# EAGLE design testjig (EAGLE 7.1.0)
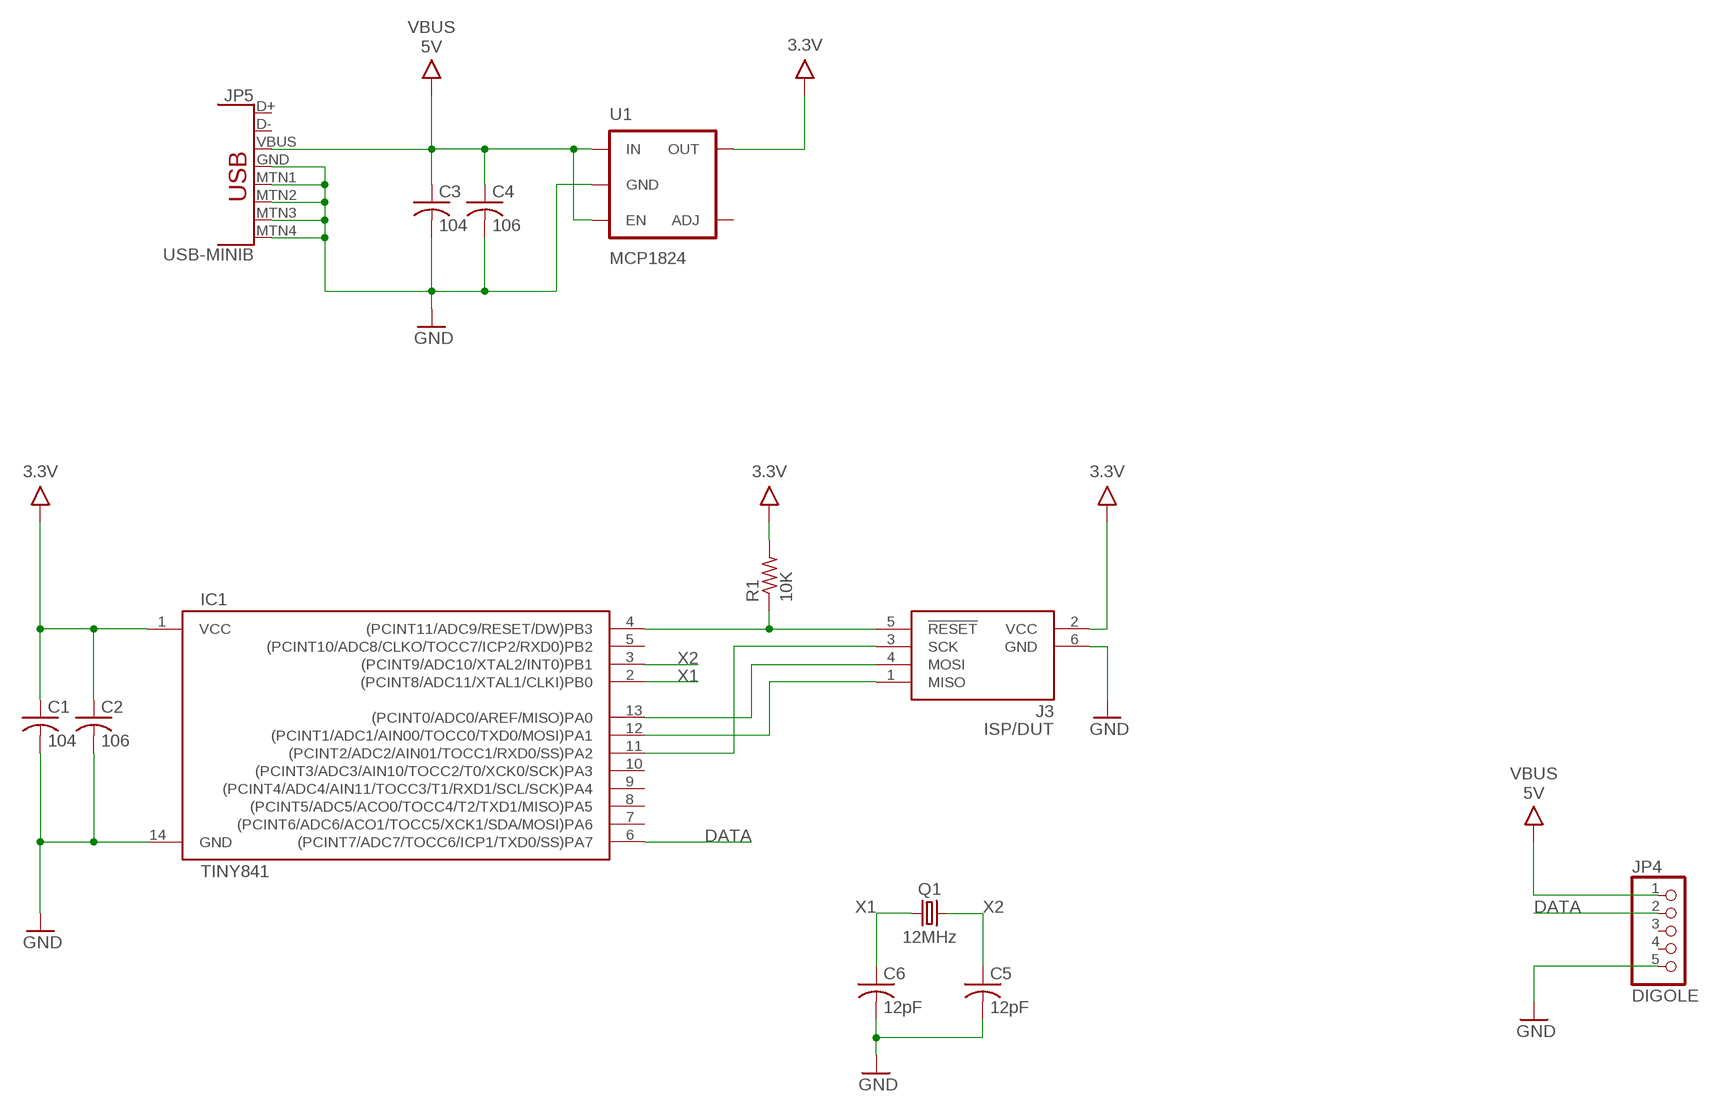
[diagram p0: schematic, sheet 1]

## Parts
C1  104  C-0603  [0603]
C2  106  C-0603  [0603]
C3  104  C-0603  [0603]
C4  106  C-0603  [0603]
C5  12pF  C-0603  [0603]
C6  12pF  C-0603  [0603]
IC1  TINY841  ATTINY441/841-SSU  [SOIC14N]
J3  ISP/DUT  AVRISP6_COMPACT  [CON6P2R]
JP4  DIGOLE  PINHD-1X05_2.54-S  [1X05-S]
JP5  USB-MINIB  [USB-MINIB]
Q1  12MHz  CRYSTALNDK5X3  [NDK_2PAD_5X3]
R1  10K  R0603  [0603]
U1  MCP1824  [SOT23-5]

## Nets
3.3V: C1.1(+) C2.1(+) IC1.1(VCC) J3.2(VCC) R1.2 U1.5(OUT)
DATA: IC1.6((PCINT7/ADC7/TOCC6/ICP1/TXD0/SS)PA7) JP4.2
GND: C1.2(-) C2.2(-) C3.2(-) C4.2(-) C5.2(-) C6.2(-) IC1.14(GND) J3.6(GND) JP4.5 JP5.GND JP5.MTN1(SHIELD1) JP5.MTN2(SHIELD2) JP5.MTN3(SHIELD3) JP5.MTN4(SHIELD4) U1.2(GND)
PA0: IC1.13((PCINT0/ADC0/AREF/MISO)PA0) J3.4(MOSI)
PA1: IC1.12((PCINT1/ADC1/AIN00/TOCC0/TXD0/MOSI)PA1) J3.1(MISO)
PA2: IC1.11((PCINT2/ADC2/AIN01/TOCC1/RXD0/SS)PA2) J3.3(SCK)
RESET: IC1.4((PCINT11/ADC9/RESET/DW)PB3) J3.5(!RESET) R1.1
VBUS: C3.1(+) C4.1(+) JP4.1 JP5.VBUS U1.1(IN) U1.3(EN) ; supply symbol labelled 5V
X1: C6.1(+) IC1.2((PCINT8/ADC11/XTAL1/CLKI)PB0) Q1.P$1
X2: C5.1(+) IC1.3((PCINT9/ADC10/XTAL2/INT0)PB1) Q1.P$2
Unconnected: IC1.5((PCINT10/ADC8/CLKO/TOCC7/ICP2/RXD0)PB2) IC1.7((PCINT6/ADC6/ACO1/TOCC5/XCK1/SDA/MOSI)PA6) IC1.8((PCINT5/ADC5/ACO0/TOCC4/T2/TXD1/MISO)PA5) IC1.9((PCINT4/ADC4/AIN11/TOCC3/T1/RXD1/SCL/SCK)PA4) IC1.10((PCINT3/ADC3/AIN10/TOCC2/T0/XCK0/SCK)PA3) JP4.3 JP4.4 JP5.D+ JP5.D- U1.4(ADJ)

## Library data of the parts
C1-C6 = bt_rcl:C: Capacitor, non-polarized, American symbol
IC1 = bt_avr:ATTINY441/841: ATtiny441, ATtiny841 AVR Microcontroller The high-performance Atmel picoPower 8-bit AVR RISC-based microcontroller combines 4KB ISP flash memory, 512-Byte EEPROM, 128B SRAM, 12 general purpose I/O lines, 32 general purpose working registers, an 8-bit timer/counter with two PWM channels, two 16-bit timer/counters with two PWM channels, internal and external interrupts, an 12-channel 10-bit A/D converter, 2 On-chip analog comparators, 2 full duplex USARTs with Start Frame wake up from power down, master/slave SPI serial interface, slave I2C serial interface, programmable gain stage (1x, 20x, and 100x) for 12 differential ADC channel pairs, programmable watchdog timer with internal oscillator, internal calibrated oscillator, and four software selectable power saving modes. The device operates between 1.7-5.5 volts. datasheet.pdf <http://www.atmel.com/Images/Atmel-8495-8-bit-AVR-Microcontrollers-ATtiny441-ATtiny841_Datasheet.pdf>
J3 = bt_avr:AVRISP6: 6-pin dual-row connector for Atmel AVRISP programmer interface
JP4 = pinhead-2:PINHD-1X05: PIN HEADER
JP5 = bt_electromech:USB: USB Connectors USB-MINI-B is fully proven USB-A-PCB is untested. USB-MICRO-B is untested.; PROD_ID: CONN-08193
Q1 = bt_crystal:CRYSTAL: CRYSTAL
R1 = bt_rcl:R: Resistor, American symbol
U1 = bt_regulator:MCP1824: MCP1824 LDO voltage regulator The MCP1824/MCP1824S is a 300 mA Low Dropout (LDO) linear regulator that provides high current and low output voltages. The MCP1824 comes in a fixed or adjustable output voltage version, with an output voltage range of 0.8V to 5.0V. Datasheet.pdf <http://ww1.microchip.com/downloads/en/devicedoc/22070a.pdf>

## Board
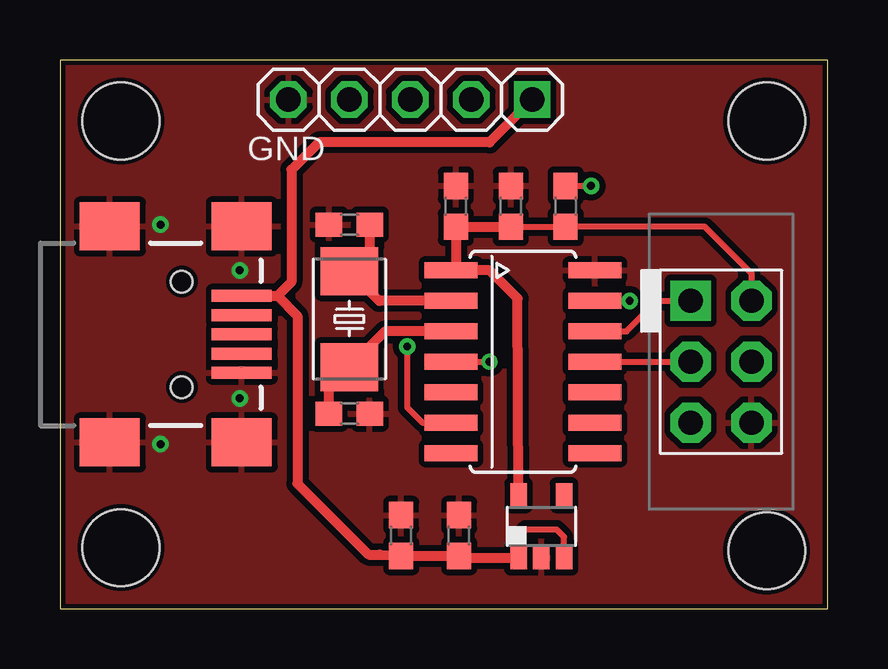
[diagram p1: board, top side]
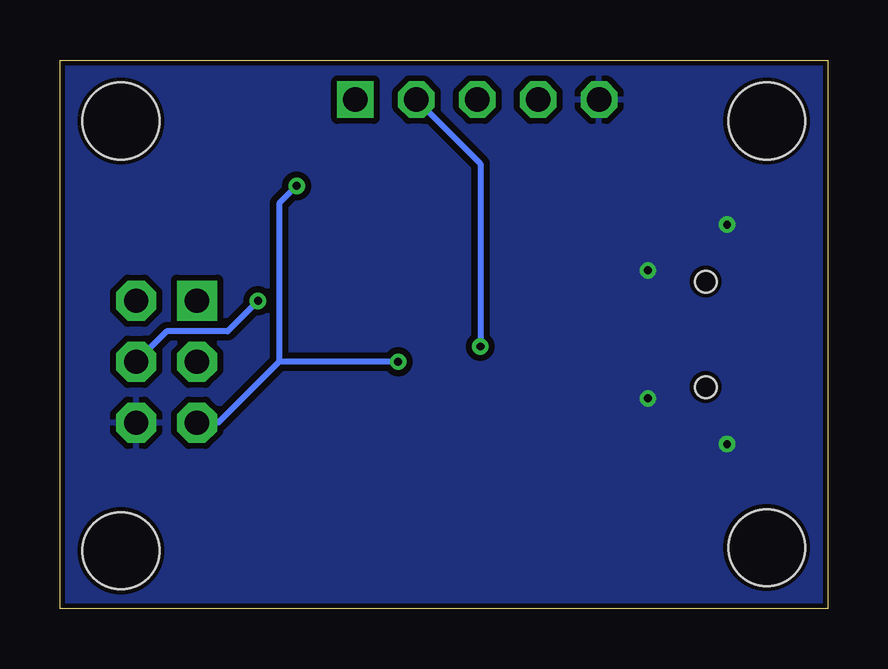
[diagram p2: board, bottom side, seen from below]

Size 32 x 22.86 mm. Coordinates in mm from the lower left corner, seen from the top.
Outline: 0,0 32,0 32,22.86 0,22.86 0,0
Copper layers (1*16): Top 0.0356mm / dielectric 1.5011mm / Bottom 0.0356mm
Design rules "LaenPCBOrder *": minimum track width 6mil, minimum drill 13mil, track to track 10mil, track to pad 10mil, pad to pad 10mil, via to via 10mil, smd to smd 8mil, copper to edge 8mil, drill to drill 8mil, minimum pad ring 7mil, minimum via ring 7mil, stop-mask expansion 3mil, vias tented up to drill 20mil, thermal gap 10mil
Holes 3.2 mm at 2.54,20.32 2.54,2.54 29.46,2.41 29.46,20.32

### Footprints (pad centres in the part's own frame; a part is rotated, then mirrored left to right if it is on the bottom)
0603 = smd 1.1 x 1: 1 -0.85,0; 2 0.85,0
SOIC14N = smd 0.66 x 2.2: 1 -3.81,-3; 2 -2.54,-3; 3 -1.27,-3; 4 0,-3; 5 1.27,-3; 6 2.54,-3; 7 3.81,-3; 8 3.81,3; 9 2.54,3; 10 1.27,3; 11 0,3; 12 -1.27,3; 13 -2.54,3; 14 -3.81,3
CON6P2R = drill 1.016 pad 1.676 square: 1 -2.54,-1.27 | drill 1.016 pad 1.676 octagon: 2 -2.54,1.27; 3 0,-1.27; 4 0,1.27; 5 2.54,-1.27; 6 2.54,1.27
1X05-S = drill 1.016 square: 1 -5.08,0 | drill 1.016 octagon: 2 -2.54,0; 3 0,0; 4 2.54,0; 5 5.08,0
USB-MINIB = smd 2.5 x 0.5: D+ 2.5,0; D- 2.5,0.8; GND 2.5,-1.6; ID 2.5,-0.8; VBUS 2.5,1.6 | smd 2.5 x 2: MTN1 -3,4.5; MTN2 2.5,4.5; MTN3 -3,-4.5; MTN4 2.5,-4.5 | hole 0.9: 0,2.2; 0,-2.2
NDK_2PAD_5X3 = smd 2 x 2.4: P$1 -2,0; P$2 2,0
SOT23-5 = smd 0.69 x 0.99: 1 -0.95,-1.3; 2 0,-1.3; 3 0.95,-1.3; 4 0.95,1.3; 5 -0.95,1.3

### Placement (x,y rotation side)
C1  16.51,16.76 90 top
C2  18.8,16.76 90 top
C3  16.64,3.05 90 top
C4  14.22,3.05 90 top
C5  12.06,8.13 0 top
C6  12.06,16 180 top
IC1  19.3,10.29 270 top
J3  27.56,10.29 270 top
JP4  14.61,21.21 180 top
JP5  5.08,11.43 0 top
Q1  12.06,12.06 270 top
R1  21.08,16.76 270 top
U1  20.07,3.43 0 top

### Tracks (layer width: path | path; a pad name or v marks a point on that pad's centre or on a via)
3.3V
  Top 0.254: C2.1 R1.2 26.89,15.91 28.83,13.97 J3.2
  Top 0.406: U1.5 19.08,12.92 17.91,14.1 17.14,14.1 | 17.14,14.1 IC1.1 16.51,14.14 C1.1 C2.1 | 17.23,14.19 17.14,14.1
DATA  (via drill 0.33)
  Top 0.254: v14.48,10.92 14.48,8.38 15.11,7.75 IC1.6
  Bottom 0.254: JP4.2 14.48,18.54 v14.48,10.92
GND  (via drill 0.33)
  other vias: 7.49,8.76 7.49,14.1 4.19,16 4.19,6.86
  pour Bottom: 0,22.86 32,22.86 32,0 0,0
  pour Top: 0,22.86 32,22.86 32,0 0,0
PA0  (via drill 0.33)
  Top 0.254: IC1.13 v23.75,12.83
  Bottom 0.254: v23.75,12.83 25.02,11.56 27.56,11.56 J3.4
PA1
  Top 0.254: IC1.12 23.62,11.56 24.89,12.83 J3.1
PA2
  Top 0.254: IC1.11 J3.3
RESET  (via drill 0.33)
  Top 0.254: IC1.4 v17.91,10.29 | R1.1 v22.14,17.61
  Bottom 0.254: v17.91,10.29 22.86,10.29 | 22.86,10.29 25.4,7.75 J3.5 | 22.86,10.29 22.86,16.89 v22.14,17.61
VBUS
  Top 0.254: U1.3 21.02,2.99 20.7,3.3 19.43,3.3 19.12,2.99 U1.1
  Top 0.406: JP5.VBUS 9.07,13.03 | 9.07,13.03 9.91,12.19 9.91,5.21 12.87,2.25 13.34,2.25 C4.1 C3.1 16.74,2.22 16.83,2.13 U1.1 | JP4.1 17.91,19.43 10.79,19.43 9.65,18.29 9.65,13.61 9.07,13.03
X1
  Top 0.406: C6.1 12.91,14.91 Q1.P$1 13.3,12.83 IC1.2
X2
  Top 0.406: C5.1 11.21,9.21 Q1.P$2 13.56,11.56 IC1.3

### Text on the board
tNames: GND